# Altium schematic sheet SiPM_Array_v3.2.SchDoc
size A4; SheetNumber: 1; SheetTotal: 1
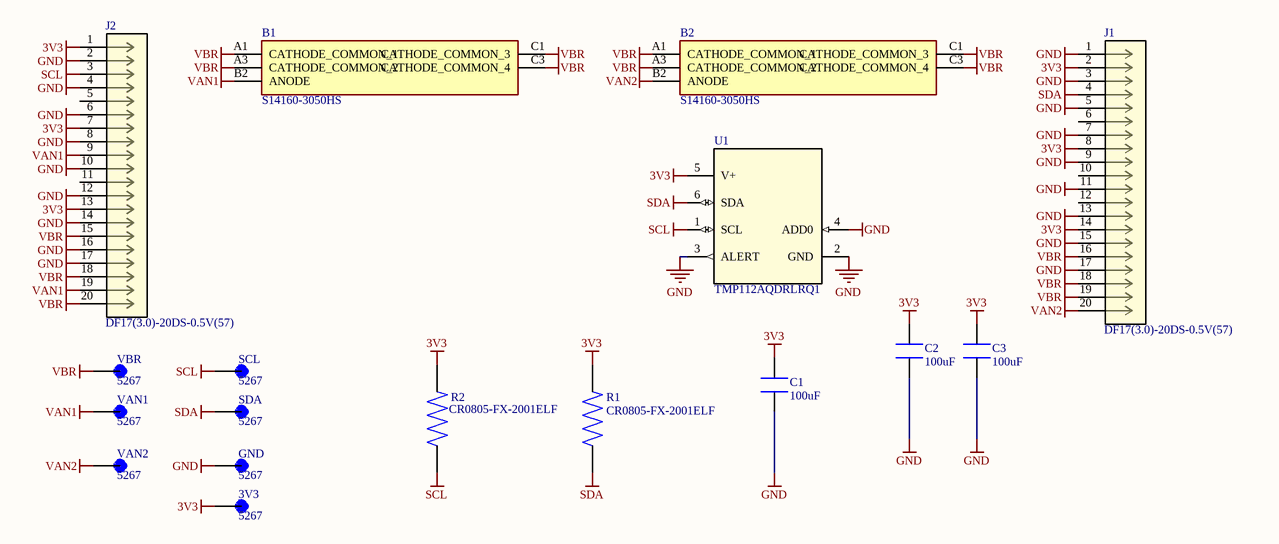
[diagram p0: SiPM_Array_v3.2.SchDoc]

## Parts
3V3  5267  [KEYSTONE_5267]
B1  S14160-3050HS  [S141603050HS]
B2  S14160-3050HS  [S141603050HS]
C1  100uF  [CAPACITOR_0805_2012M-70N]
C2  100uF  [CAPACITOR_0805_2012M-70N]
C3  100uF  [CAPACITOR_0805_2012M-70N]
GND  5267  [KEYSTONE_5267]
J1  DF17(3.0)-20DS-0.5V(57)  [CONN_DF173.0-20DS-0.5V57_HIR]
J2  DF17(3.0)-20DS-0.5V(57)  [CONN_DF173.0-20DS-0.5V57_HIR]
R1  CR0805-FX-2001ELF  [RESC2012X60N]
R2  CR0805-FX-2001ELF  [RESC2012X60N]
SCL  5267  [KEYSTONE_5267]
SDA  5267  [KEYSTONE_5267]
U1  TMP112AQDRLRQ1  [DRL0006A]
VAN1  5267  [KEYSTONE_5267]
VAN2  5267  [KEYSTONE_5267]
VBR  5267  [KEYSTONE_5267]

## Nets
3V3: 3V3.TP C1.2 C2.2 C3.2 J1.2 J1.8 J1.14 J2.1 J2.7 J2.13 R1.1 R2.1 U1.5(V+)
GND: C1.1 C2.1 C3.1 GND.TP J1.1 J1.3 J1.5 J1.7 J1.9 J1.11 J1.13 J1.15 J1.17 J2.2 J2.4 J2.6 J2.8 J2.10 J2.12 J2.14 J2.16 J2.17 U1.2(GND) U1.3(ALERT) U1.4(ADD0)
SCL: J2.3 R2.2 SCL.TP U1.1(SCL)
SDA: J1.4 R1.2 SDA.TP U1.6(SDA)
VAN1: B1.B2(ANODE) J2.9 J2.19 VAN1.TP
VAN2: B2.B2(ANODE) J1.20 VAN2.TP
VBR: B1.A1(CATHODE_COMMON_1) B1.A3(CATHODE_COMMON_2) B1.C1(CATHODE_COMMON_3) B1.C3(CATHODE_COMMON_4) B2.A1(CATHODE_COMMON_1) B2.A3(CATHODE_COMMON_2) B2.C1(CATHODE_COMMON_3) B2.C3(CATHODE_COMMON_4) J1.16 J1.18 J1.19 J2.15 J2.18 J2.20 VBR.TP

Not connected (* = marked no-connect by the designer): J1 6 10 12; J2 5 11

## Library data of the parts
3V3 GND SCL SDA VAN1 VAN2 VBR = 5267: TEST POINT (BLUE) - MINIATURE; MF: Keystone Electronics; SnapEDA_Link: https://www.snapeda.com/parts/5267/Keystone/view-part/?ref=snap; Package: None; Value: *; MP: 5267; Check_prices: https://www.snapeda.com/parts/5267/Keystone/view-part/?ref=eda
B1 B2 = S14160-3050HS: The S14160 series achieve higher PDE (photon detection efficiency) and lower operation voltage than other MPPC to adapt for PET and radiation monitor application.-Higher PDE: 50% at p, Vop=VBR + 2.7 V; Manufacturer_Name: Hamamatsu; Geometry.Height: 1.55mm; Manufacturer_Part_Number: S14160-3050HS; Mouser Part Number: *; Mouser Price/Stock: *; Arrow Part Number: *; Arrow Price/Stock: *; Datasheet Link: https://www.hamamatsu.com/content/dam/hamamatsu-photonics/sites/documents/99_SALES_LIBRARY/ssd/s14160_s14161_series_kapd1064e.pdf
C1-C3 = GRM21BR60J107ME15L: Passive - Capacitor, 0805, 100uF Max, X5R, 6.3V ±20%, -55°C ~ 85°C, 0805 (2012 Metric). 20uF @ 6.3V; APSS Standard Part: APSS Standard; Tolerance: ±20%; Temperature Coefficient: X5R; Capacitance at Rated Voltage: 20%; Rated Voltage: 6.3V; Temp Range: -55°C ~ 85°C; Package: 0805; Supplier 1: Digikey; Supplier 1 Part No.: 490-GRM155R61E225KE11JCT-ND; MF Part No.: GRM21BR60J107ME15L; Value: 100uF
J1 J2 = DF173.0-20DS-0.5V57: Description; Manufacturer_Name: Hirose; Copyright: Copyright (C) 2025 Ultra Librarian. All rights reserved.; Manufacturer_Part_Number: DF17(3.0)-20DS-0.5V(57); RefDes: RefDes; Type: Type
R1 R2 = CR0805-FX-2001ELF: Res 0805 2k 1% 125mW | Bourns CR0805-FX-2001ELF; SnapEDA_Link: https://www.snapeda.com/parts/CR0805-FX-2001ELF/Bourns/view-part/?ref=snap; Package: 0805 Bourns; Value: *; MF: Bourns; MP: CR0805-FX-2001ELF; Check_prices: https://www.snapeda.com/parts/CR0805-FX-2001ELF/Bourns/view-part/?ref=eda
U1 = TMP112AQDRLRQ1: No Description Available; Mfr_Name: Texas Instruments; CompType: IC; TYPE: TYPE; RefDes: RefDes; PartNumber: TMP112AQDRLRQ1; PackageReference: DRL0006A; MountType: SMT; RoHS: Y; Manufacturer: Texas Instruments